# Altium schematic sheet DCDC_5V.SchDoc
size 420 x 297 mm; SheetNumber: 1; SheetTotal: 5
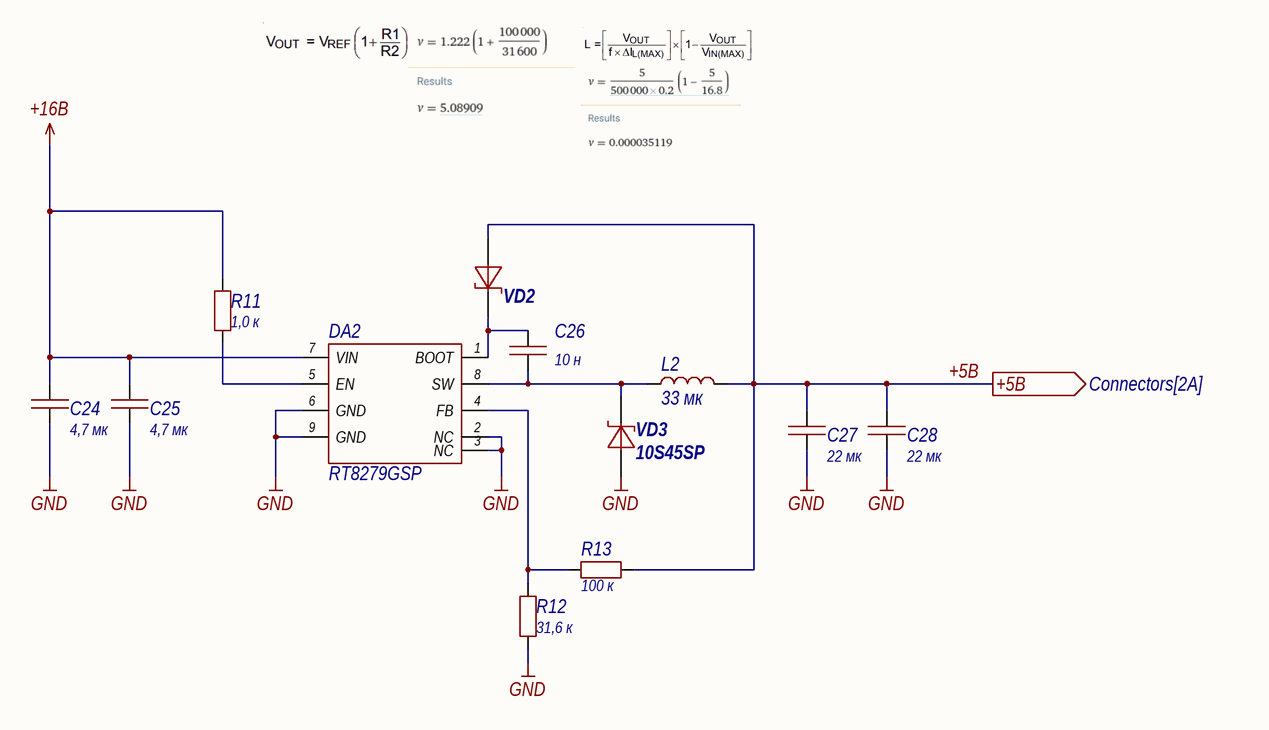
[diagram p0: DCDC_5V.SchDoc]

## Parts
C24  value 4,7 мк  [1206C]  (hidden comment: Capacitor)
C25  value 4,7 мк  [1206C]  (hidden comment: Capacitor)
C26  value 10 н  [0603C]  (hidden comment: Capacitor)
C27  value 22 мк  [1210C]  (hidden comment: Capacitor)
C28  value 22 мк  [1210C]  (hidden comment: Capacitor)
DA2  RT8279GSP  [8SOP(Exposed_Pad)]
L2  value 33 мк  [IHLP-4040]  (hidden comment: IHLP4040DZER330M11)
R11  value 1,0 к  [0603R]  (hidden comment: Resistor)
R12  value 31,6 к  [0603R]  (hidden comment: Resistor)
R13  value 100 к  [0603R]  (hidden comment: Resistor)
VD2  BAT54WS  [SOD-323]  (value not drawn)
VD3  10S45SP  [TO-277]

## Ports
+5В (out, see Connectors[2A])

## Nets
+16В: C24.2 C25.2 DA2.7(VIN) R11.2
GND: C24.1 C25.1 C27.1 C28.1 DA2.2(NC) DA2.3(NC) DA2.6(GND) DA2.9(GND) R12.1 VD3.1
+5В: C27.2 C28.2 L2.2 R13.2 VD2.1 ; port +5В
NetC26_1: C26.1 DA2.8(SW) L2.1 VD3.2
NetC26_2: C26.2 DA2.1(BOOT) VD2.2
NetDA2_4: DA2.4(FB) R12.2 R13.1
NetDA2_5: DA2.5(EN) R11.1

## Notes on the sheet
- Перв. примен.
- Справ. №
- Подп. и дата
- Инв. № дубл.
- Взам. инв. №
- Разраб.
- Изм.
- Лист
- № докум.
- Подп.
- Дата
- Лит.
- Масса
- Масштаб
- Пров.
- Т.контр.
- Схема электрическая принципиальная
- Листов
- Инв. № подл.
- Утв.
- Н.контр.
- Копировал
- Формат А3

## Library data of the parts
C24 C25 = Capacitor_4,7u_10_50V_X7R_1206C: Конденсатор; Library Path2: Schematic\Capacitor.SchLib; Tolerance: 0,1; Voltage (V): 50; Dielectric: X7R; Capacity (nF): 4700; Part Number: Capacitor_4,7u_10_50V_X7R_1206C
C26 = Capacitor_10n_10_50V_X7R_0603C: Конденсатор; Library Path2: Schematic\Capacitor.SchLib; Tolerance: 0,1; Voltage (V): 50; Dielectric: X7R; Capacity (nF): 10; Part Number: Capacitor_10n_10_50V_X7R_0603C
C27 C28 = Capacitor_22u_10_25V_X7R_1210C: Конденсатор; Library Path2: Schematic\Capacitor.SchLib; Tolerance: 0,1; Voltage (V): 25; Dielectric: X7R; Capacity (nF): 22000; Part Number: Capacitor_22u_10_25V_X7R_1210C
DA2 = RT8279GSP: Преобразователь постоянного тока понижающий подстраиваемый выход 5А; Part Number: RT8279GSP
L2 = IHLP4040DZER330M11: ЧИП-индуктивность экранированная 33мкГн ±20% 4,4A 94,5мОм 4040; Inductance (μH): 33; Current (A): 4,4; Part Number: IHLP4040DZER330M11
R11 = Resistor_1.0k_1_0603: Резистор номиналом 1,0 кОм и точностью 1%; Power: *; Part Number: Resistor_1.0k_1_0603; Tolerance: 1%
R12 = Resistor_31.6k_1_0603: Резистор номиналом 31,6 кОм и точностью 1%; Power: *; Part Number: Resistor_31.6k_1_0603; Tolerance: 1%
R13 = Resistor_100k_1_0603: Резистор номиналом 100 кОм и точностью 1%; Power: *; Part Number: Resistor_100k_1_0603; Tolerance: 1%
VD2 = BAT54WS: Диод шоттки на 30 В, ном. ток 0.2 А; Voltage nominal (V): 30; Current (A): 0.2; Part Number: BAT54WS
VD3 = 10S45SP: Диод шоттки на 45 В, ном. ток 10 А; Voltage nominal (V): 45; Current (A): 10; Part Number: 10S45SP